# Altium schematic sheet VNA_0.SchDoc: VNA
size 409 x 289 mm; Origin: Eagle; OriginPath: C:\Users\Ground Lab\Desktop\LibreVNA\Hardware\Eagle\VNA.sch; OriginSheet: 1; Date: 04.05.2025 20:03:37; SheetNumber: 1; GateName_1: G$1; SymbolName_1: A3L-LOC; LibraryName: VNA; DeviceSetName: A3L-LOC; Sheet: Sheet:
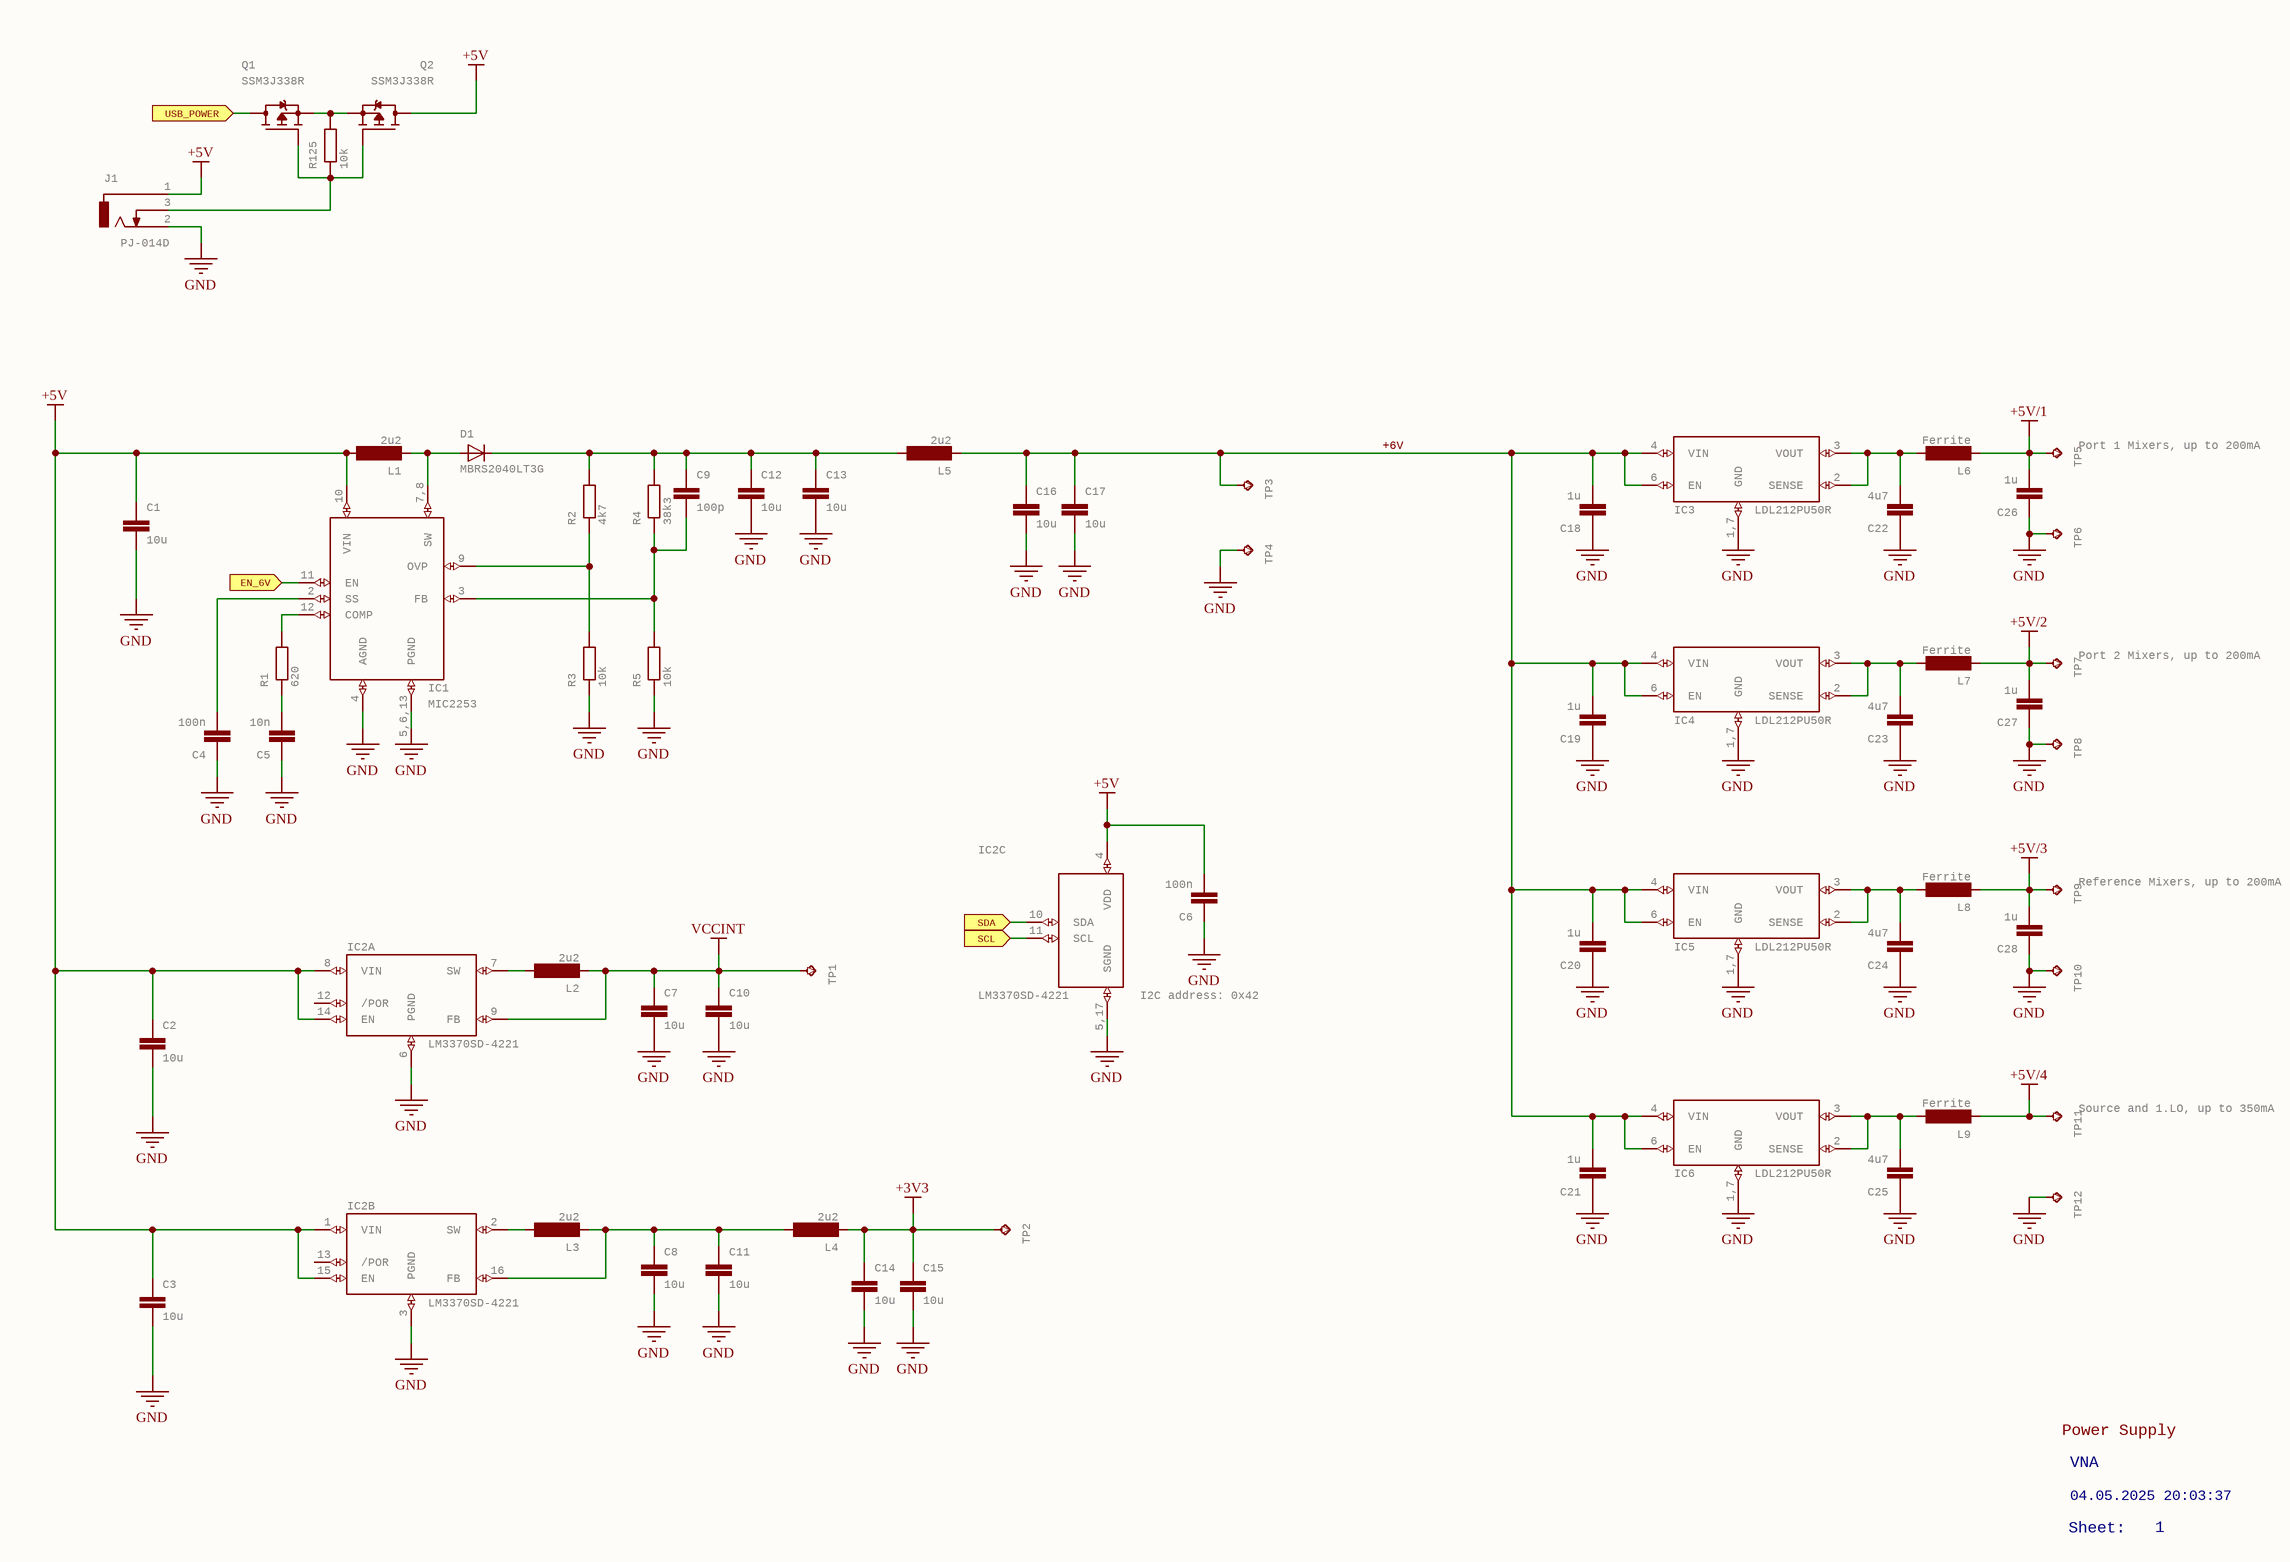
[diagram p0: VNA_0.SchDoc]

## Parts
C1  10u  [C1206]
C2  10u  [C1206]
C3  10u  [C1206]
C4  100n  [C0402]
C5  10n  [C0402]
C6  100n  [C0402]
C7  10u  [C1206]
C8  10u  [C1206]
C9  100p  [C0402]
C10  10u  [C1206]
C11  10u  [C1206]
C12  10u  [C1206]
C13  10u  [C1206]
C14  10u  [C1206]
C15  10u  [C1206]
C16  10u  [C1206]
C17  10u  [C1206]
C18  1u  [C0603]
C19  1u  [C0603]
C20  1u  [C0603]
C21  1u  [C0603]
C22  4u7  [C0603]
C23  4u7  [C0603]
C24  4u7  [C0603]
C25  4u7  [C0603]
C26  1u  [C0603]
C27  1u  [C0603]
C28  1u  [C0603]
D1  MBRS2040LT3G  [SMB]
IC1  MIC2253  [SON50P300X300X90-13T170X240N]
IC2  LM3370SD-4221  [SON50P400X500X80-17T260X400N]  (parts A,B,C of 3)
IC3  LDL212PU50R  [SON95P300X300X100-7T170X240N]
IC4  LDL212PU50R  [SON95P300X300X100-7T170X240N]
IC5  LDL212PU50R  [SON95P300X300X100-7T170X240N]
IC6  LDL212PU50R  [SON95P300X300X100-7T170X240N]
J1  PJ-014D  [PJ-014D]
L1  2u2  [SRN5040]
L2  2u2  [SRN5040]
L3  2u2  [SRN5040]
L4  2u2  [SRN5040]
L5  2u2  [SRN5040]
L6  Ferrite  [R0402]
L7  Ferrite  [R0402]
L8  Ferrite  [R0402]
L9  Ferrite  [R0402]
Q1  SSM3J338R  [SOTFL95P240X80-3N]
Q2  SSM3J338R  [SOTFL95P240X80-3N]
R1  620  [R0402]
R2  4k7  [R0402]
R3  10k  [R0402]
R4  38k3  [R0402]
R5  10k  [R0402]
R125  10k  [R0402]
TP1  TPB1,27  [B1,27]  (value not drawn)
TP2  TPB1,27  [B1,27]  (value not drawn)
TP3  TPB1,27  [B1,27]  (value not drawn)
TP4  TPB1,27  [B1,27]  (value not drawn)
TP5  TPB1,27  [B1,27]  (value not drawn)
TP6  TPB1,27  [B1,27]  (value not drawn)
TP7  TPB1,27  [B1,27]  (value not drawn)
TP8  TPB1,27  [B1,27]  (value not drawn)
TP9  TPB1,27  [B1,27]  (value not drawn)
TP10  TPB1,27  [B1,27]  (value not drawn)
TP11  TPB1,27  [B1,27]  (value not drawn)
TP12  TPB1,27  [B1,27]  (value not drawn)

## Ports
EN_6V (in), SCL (in), SDA (in), USB_POWER (in)

## Nets
+3V3: C14.1 C15.1 L4.P$2 TP2.TP
+5V: C1.1 C2.1 C3.1 C6.2 IC1.10(VIN) IC2.1(VIN) IC2.4(VDD) IC2.8(VIN) IC2.14(EN) IC2.15(EN) J1.1 L1.P$1 Q2.3(D)
+5V/1: C26.2 L6.2 TP5.TP
+5V/2: C27.2 L7.2 TP7.TP
+5V/3: C28.2 L8.2 TP9.TP
+5V/4: L9.2 TP11.TP
GND: C1.2 C2.2 C3.2 C4.1 C5.1 C6.1 C7.2 C8.2 C10.2 C11.2 C12.2 C13.2 C14.2 C15.2 C16.2 C17.2 C18.1 C19.1 C20.1 C21.1 C22.1 C23.1 C24.1 C25.1 C26.1 C27.1 C28.1 IC1.4(AGND) IC1.5,6,13(PGND) IC2.3(PGND) IC2.5,17(SGND) IC2.6(PGND) IC3.1,7(GND) IC4.1,7(GND) IC5.1,7(GND) IC6.1,7(GND) J1.2 R3.1 R5.1 TP4.TP TP6.TP TP8.TP TP10.TP TP12.TP
VCCINT: C7.1 C10.1 IC2.9(FB) L2.P$2 TP1.TP
+6V: C16.1 C17.1 C18.2 C19.2 C20.2 C21.2 IC3.4(VIN) IC3.6(EN) IC4.4(VIN) IC4.6(EN) IC5.4(VIN) IC5.6(EN) IC6.4(VIN) IC6.6(EN) L5.P$2 TP3.TP
EN_6V: IC1.11(EN) ; port EN_6V
SCL: IC2.11(SCL) ; port SCL
SDA: IC2.10(SDA) ; port SDA
USB_POWER: Q1.3(D) ; port USB_POWER
NetC4_2: C4.2 IC1.2(SS)
NetC5_2: C5.2 R1.1
NetC8_1: C8.1 C11.1 IC2.16(FB) L3.P$2 L4.P$1
NetC9_1: C9.1 C12.1 C13.1 D1.C L5.P$1 R2.2 R4.2
NetC9_2: C9.2 IC1.3(FB) R4.1 R5.2
NetC22_2: C22.2 IC3.2(SENSE) IC3.3(VOUT) L6.1
NetC23_2: C23.2 IC4.2(SENSE) IC4.3(VOUT) L7.1
NetC24_2: C24.2 IC5.2(SENSE) IC5.3(VOUT) L8.1
NetC25_2: C25.2 IC6.2(SENSE) IC6.3(VOUT) L9.1
NetD1_A: D1.A IC1.7,8(SW) L1.P$2
NetIC1_9: IC1.9(OVP) R2.1 R3.2
NetIC1_12: IC1.12(COMP) R1.2
NetIC2_2: IC2.2(SW) L3.P$1
NetIC2_7: IC2.7(SW) L2.P$1
NetJ1_3: J1.3 Q1.1(G) Q2.1(G) R125.1
NetQ1_2: Q1.2(S) Q2.2(S) R125.2

Not connected (* = marked no-connect by the designer): IC2 12(/POR) 13(/POR)

## Notes on the sheet
- (near TP5) Port 1 Mixers, up to 200mA
- (near TP7) Port 2 Mixers, up to 200mA
- (near TP9) Reference Mixers, up to 200mA
- (near IC2) I2C address: 0x42
- (near TP11) Source and 1.LO, up to 350mA
- Power Supply
- VNA
- Sheet:
- 04.05.2025 20:03:37
- 1

## Library data of the parts
C1-C3 C7 C8 C10-C17 = C-EUC1206: CAPACITOR, European symbol; GateName_1: G$1; SymbolName_1: C-EU; DeviceName: C1206; LibraryName: VNA; DeviceSetName: C-EU
C4-C6 C9 = C-EU*?:2C0402: CAPACITOR, European symbol; GateName_1: G$1; SymbolName_1: C-EU:1; DeviceName: C0402; LibraryName: VNA; DeviceSetName: C-EU*?:2
C18-C28 = C-EU*?:1C0603: CAPACITOR, European symbol; GateName_1: G$1; SymbolName_1: C-EU-1; DeviceName: C0603; LibraryName: VNA; DeviceSetName: C-EU*?:1
D1 = D-SMB: DIODE; GateName_1: G$1; SymbolName_1: D; DeviceSetName: D-; DeviceName: SMB; LibraryName: VNA
IC1 = MIC2253: GateName_1: G$1; SymbolName_1: MIC2253; LibraryName: VNA; DeviceSetName: MIC2253
IC2 = LM3370: GateName_1: BUCK1; SymbolName_1: LM3370_BUCK; GateName_2: BUCK2; GateName_3: CONTROL; SymbolName_3: LM3370_CONTROL; SymbolName_2: LM3370_BUCK; LibraryName: VNA; DeviceSetName: LM3370
IC3-IC6 = LDL212PU50R: GateName_1: G$1; SymbolName_1: LDL212; LibraryName: VNA; DeviceSetName: LDL212PU50R
J1 = PJ-014D: GateName_1: G$1; SymbolName_1: DC-JACK-SWITCH; LibraryName: VNA; DeviceSetName: PJ-014D
L1-L5 = SRN5040: GateName_1: G$1; SymbolName_1: L-EU; LibraryName: VNA; DeviceSetName: SRN5040
L6-L9 = FERRITE: GateName_1: G$1; SymbolName_1: L-EU:1; LibraryName: VNA; DeviceSetName: FERRITE
Q1 Q2 = SSM3J338R: GateName_1: G$1; SymbolName_1: P-MOSFET; LibraryName: VNA; DeviceSetName: SSM3J338R
R1-R5 R125 = R-EU_R0402: RESISTOR, European symbol; GateName_1: G$1; SymbolName_1: R-EU; DeviceSetName: R-EU_; DeviceName: R0402; LibraryName: VNA
TP1-TP12 = TPB1,27: Test pad; GateName_1: G$1; SymbolName_1: TP; DeviceName: B1,27; LibraryName: VNA; DeviceSetName: TP